# EAGLE design Trace Test (EAGLE 6.5.0)
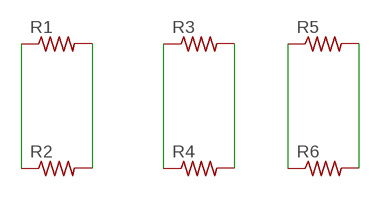
[diagram p0: schematic, sheet 1]

## Parts
R1  R-US_0204/5  [0204/5]
R2  R-US_0204/5  [0204/5]
R3  R-US_0204/5  [0204/5]
R4  R-US_0204/5  [0204/5]
R5  R-US_0204/5  [0204/5]
R6  R-US_0204/5  [0204/5]

## Nets
N$1: R1.1 R2.1
N$2: R1.2 R2.2
N$3: R3.1 R4.1
N$4: R3.2 R4.2
N$5: R5.1 R6.1
N$6: R5.2 R6.2

## Library data of the parts
R1-R6 = adafruit:R-US_: RESISTOR, American symbol

## Net classes
0 default: width 1.27 mm, drill 0.889 mm, clearance 0.508 mm

## Board
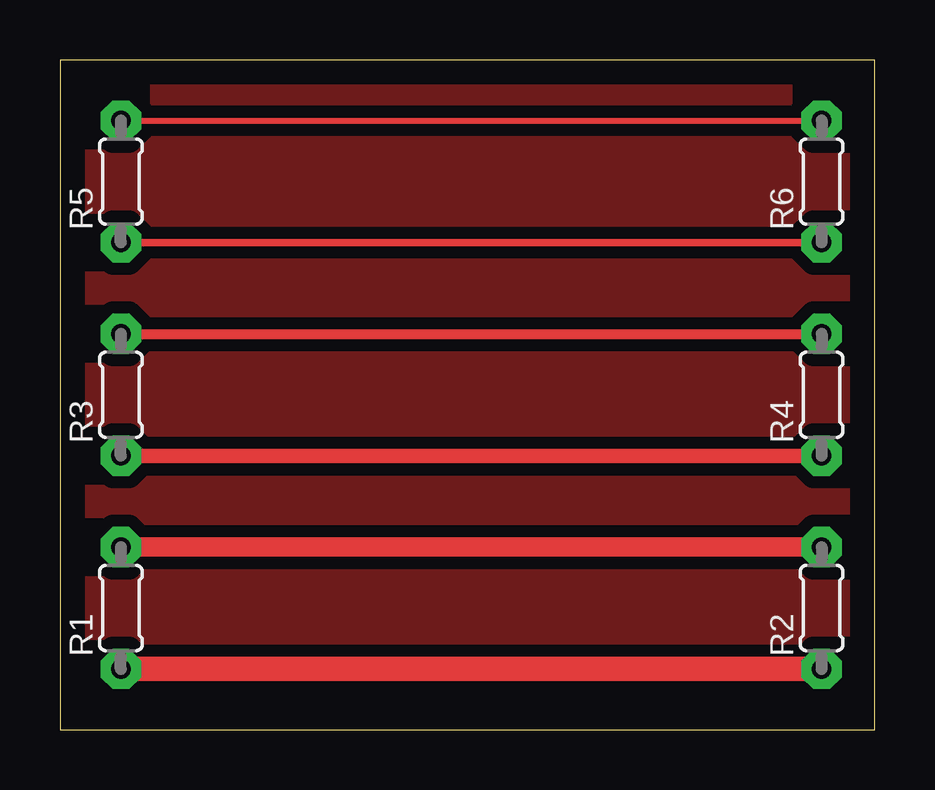
[diagram p1: board, top side]

Size 33.96 x 27.93 mm. Coordinates in mm from the lower left corner, seen from the top.
Outline: 0,0 33.96,0 33.96,27.93 0,27.93 0,0
Copper layers (1*16): Top 0.035mm / dielectric 1.5mm / Bottom 0.035mm
Design rules "default": minimum track width 10mil, minimum drill 24mil, track to track 8mil, track to pad 8mil, pad to pad 8mil, via to via 8mil, smd to smd 8mil, copper to edge 40mil, drill to drill 8mil, minimum pad ring 10mil, minimum via ring 8mil, stop-mask expansion 4mil, vias tented up to drill 0mil, thermal gap 10mil

### Footprints (pad centres in the part's own frame; a part is rotated, then mirrored left to right if it is on the bottom)
0204/5 = drill 0.813 pad 1.676 octagon: 1 -2.54,0; 2 2.54,0

### Placement (x,y rotation side)
R1  2.54,5.08 90 top
R2  31.75,5.08 90 top
R3  2.54,13.97 90 top
R4  31.75,13.97 90 top
R5  2.54,22.86 90 top
R6  31.75,22.86 90 top

### Tracks (layer width: path | path; a pad name or v marks a point on that pad's centre or on a via)
N$1
  Top 1.016: R1.1 R2.1
N$2
  Top 0.813: R1.2 R2.2
N$3
  Top 0.61: R3.1 R4.1
N$4
  Top 0.406: R3.2 R4.2
N$5
  Top 0.305: R5.1 R6.1
N$6
  Top 0.254: R5.2 R6.2
N$7
  pour Top: 0,28 0,0 34,0 34,28